# Altium schematic sheet IC_Power.SchDoc: IC Power
size 431 x 279 mm; Author: Eric Liu; SheetNumber: 6; SheetTotal: 7
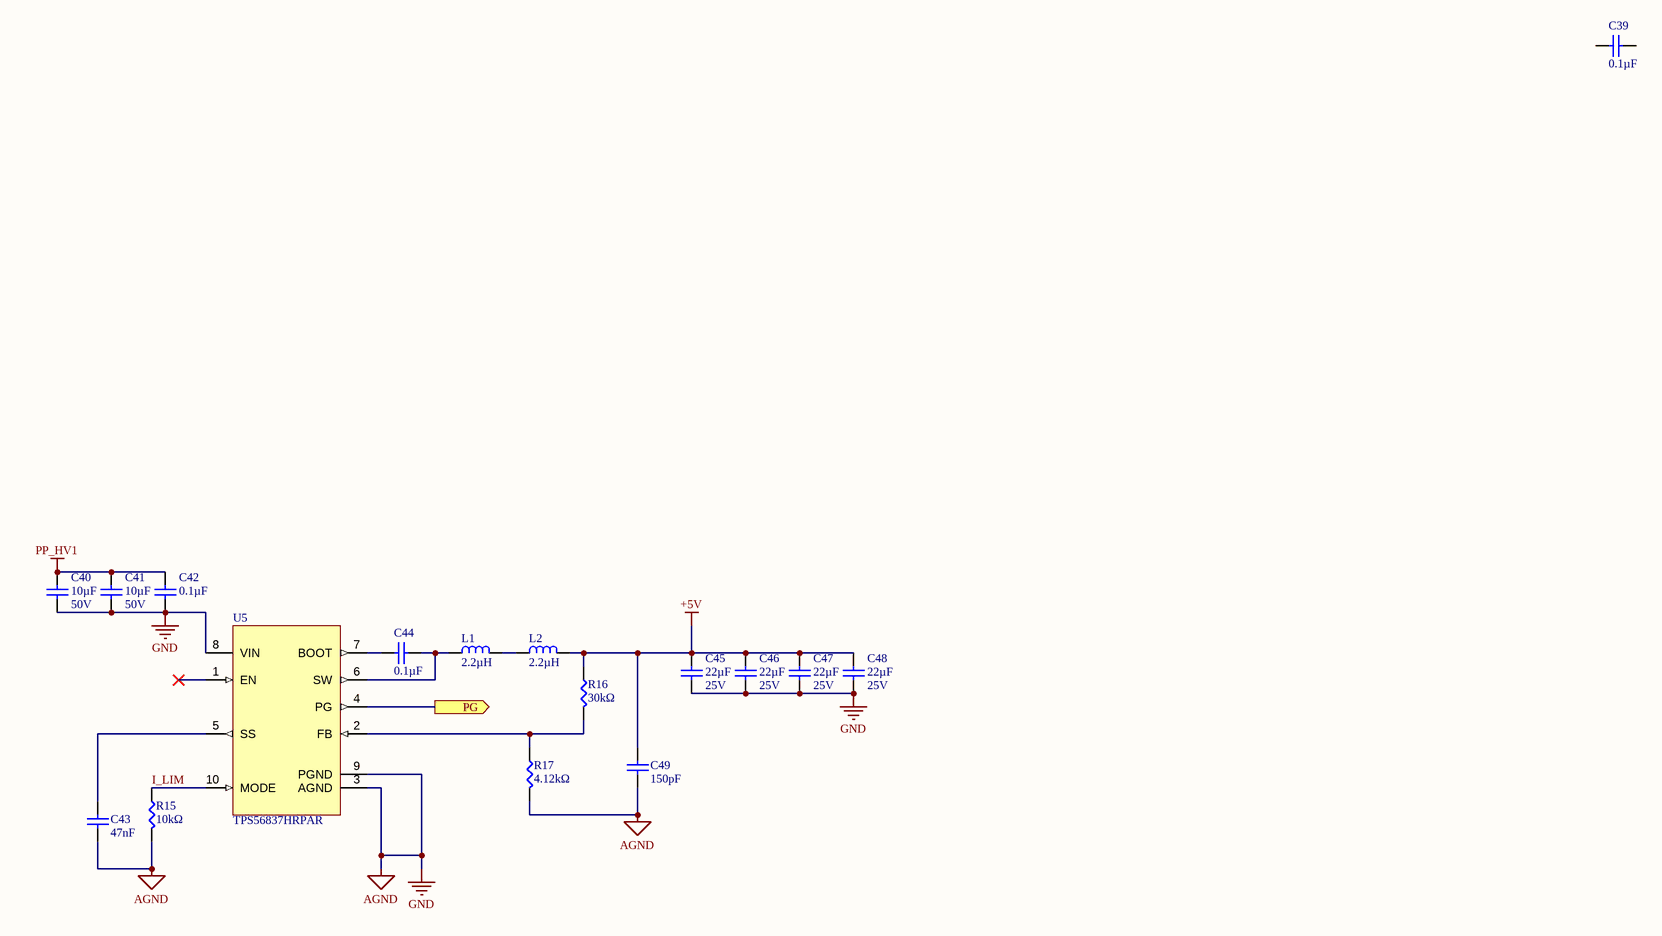
[diagram p0: IC_Power.SchDoc]

## Parts
C39  value 0.1µF  [CAP0402]  (hidden comment: CC0402KRX5R9BB104)
C40  value 10µF  Voltage: 50V  [CAP1206]  (hidden comment: CL31A106KBHNNNE)
C41  value 10µF  Voltage: 50V  [CAP1206]  (hidden comment: CL31A106KBHNNNE)
C42  value 0.1µF  [CAP0402]  (hidden comment: CC0402KRX5R9BB104)
C43  value 47nF  [CAP0402]  (hidden comment: GRM155R71H473KE14D)
C44  value 0.1µF  [CAP0402]  (hidden comment: CC0402KRX5R9BB104)
C45  value 22µF  Voltage: 25V  [CAP0805]  (hidden comment: CL21A226MAYNNNE)
C46  value 22µF  Voltage: 25V  [CAP0805]  (hidden comment: CL21A226MAYNNNE)
C47  value 22µF  Voltage: 25V  [CAP0805]  (hidden comment: CL21A226MAYNNNE)
C48  value 22µF  Voltage: 25V  [CAP0805]  (hidden comment: CL21A226MAYNNNE)
C49  value 150pF  [CAP0402]  (hidden comment: GCM1555C1H151JA16J)
L1  value 2.2µH  (hidden comment: AMELH6020S-2R2MT)
L2  value 2.2µH  (hidden comment: AMELH6020S-2R2MT)
R15  value 10kΩ  [RES0402]  (hidden comment: RC0402FR-0710KL)
R16  value 30kΩ  [RES0402]  (hidden comment: ERJ-2RKF3002X)
R17  value 4.12kΩ  [RES0402]  (hidden comment: RMCF0402FT4K12)
U5  TPS56837HRPAR

## Ports
PG (out)

## Nets
+5V: C45.2 C46.2 C47.2 C48.2 C49.2 L2.2 R16.2
AGND: C40.1 C41.1 C42.1 C43.1 C45.1 C46.1 C47.1 C48.1 C49.1 R15.1 R17.1 U5.3(AGND) U5.8(VIN) U5.9(PGND)  [also labelled GND]
PP_HV1: C40.2 C41.2 C42.2
I_LIM: R15.2 U5.10(MODE)
PG: U5.4(PG) ; port PG
NetC43_2: C43.2 U5.5(SS)
NetC44_1: C44.1 U5.7(BOOT)
NetC44_2: C44.2 L1.1 U5.6(SW)
NetL1_2: L1.2 L2.1
NetR16_1: R16.1 R17.2 U5.2(FB)

Not connected (* = marked no-connect by the designer): C39 1 2; U5 1(EN)*

## Notes on the sheet
- DWG. NO.
- REV.
- SHT.
- THIS DOCUMENT AND THE DATA DISCLOSED HEREIN OR HEREWITH IS THE PROPERTY OF ALTIUM LIMITED AND MAY BE FREELY DISTRIBUTED IN WHOLE. NO RIGHTS ARE RESERVED OR EXPRESS OR IMPLIED WARANTEE GIVEN.
- REVISION
- DESCRIPTION
- DATE
- APPROVED
- ENG:
- APPROVALS
- PROJECT
- DSN:
- CHK:
- REFERENCE DOCUMENTS
- PROJECT REVISION:
- TITLE
- DOCUMENT REVISION:
- DESIGN ITEM:
- BOM:
- FAB DWG:
- PCB DWG:
- ASSY DWG:
- SCALE:
- SIZE
- B
- CAGE CODE
- FILE NAME
- DWG NO.
- SHEET
- OF
- REV

## Library data of the parts
C39 C42 C44 = CC0402KRX5R9BB104: 0.1 µF ±10% 50V Ceramic Capacitor X5R 0402 (1005 Metric); Temperature Coefficient: X5R; Package: 0402 (1005 Metric); Voltage: 50V
C40 C41 = CL31A106KBHNNNE: 10 µF ±10% 50V Ceramic Capacitor X5R 1206 (3216 Metric); Temperature Coefficient: X5R; Package: 1206 (3216 Metric)
C43 = GRM155R71H473KE14D: 0.047 µF ±10% 50V Ceramic Capacitor X7R 0402 (1005 Metric); Temperature Coefficient: X7R; Package: 0402 (1005 Metric); Voltage: 50V
C45-C48 = CL21A226MAYNNNE: 22 µF ±20% 25V Ceramic Capacitor X5R 0805 (2012 Metric); Temperature Coefficient: X5R; Package: 0805 (2012 Metric)
C49 = GCM1555C1H151JA16J: 150 pF ±5% 50V Ceramic Capacitor C0G, NP0 0402 (1005 Metric); Temperature Coefficient: C0G, NP0; Package: 0402 (1005 Metric); Voltage: 50V
L1 L2 = AMELH6020S-2R2MT: 2.2 µH Shielded Molded Inductor 11.5 A 14.4mOhm Max Nonstandard; Manufacturer 1: Abracon LLC; Current Rating: 11.5A; Current - Saturation (Isat): 10A; Manufacturer Part Number 1: AMELH6020S-2R2MT; Supplier Part Number 1: 535-AMELH6020S-2R2MTCT-ND; Supplier 1: Digi-Key
R15 = RC0402FR-0710KL: 10 kOhms ±1% 0.063W, 1/16W Chip Resistor 0402 (1005 Metric) Moisture Resistant Thick Film; Manufacturer 1: YAGEO; Manufacturer Part Number 1: RC0402FR-0710KL; Supplier Part Number 1: 311-10.0KLRCT-ND; Supplier 1: Digi-Key; Power Rating: 1/16W
R16 = ERJ-2RKF3002X: 30 kOhms ±1% 0.1W, 1/10W Chip Resistor 0402 (1005 Metric) Automotive AEC-Q200 Thick Film; Manufacturer 1: Panasonic Electronic Components; Manufacturer Part Number 1: ERJ-2RKF3002X; Supplier Part Number 1: P30.0KLCT-ND; Supplier 1: Digi-Key; Power Rating: 1/10W
R17 = RMCF0402FT4K12: 4.12 kOhms ±1% 0.063W, 1/16W Chip Resistor 0402 (1005 Metric) Automotive AEC-Q200 Thick Film; Manufacturer 1: Stackpole Electronics Inc; Manufacturer Part Number 1: RMCF0402FT4K12; Supplier Part Number 1: RMCF0402FT4K12CT-ND; Supplier 1: Digi-Key; Power Rating: 1/16W
U5 = TPS56837HRPAR: Buck Switching Regulator IC Positive Adjustable 4V 1 Output 8A 10-PowerVFQFN; Manufacturer: Texas Instruments; Manufacturer Product Number: TPS56837HRPAR; Supplier: DigiKey; Supplier Part Number: 296-TPS56837HRPARCT-ND; Datasheet: https://www.ti.com/lit/ds/symlink/tps56837h.pdf?ts=1769746400344&ref_url=https%253A%252F%252Fwww.ti.com%252Fproduct%252FTPS56837H%252Fpart-details%252FTPS56837HARPAR; Operating Temperature: -40°C ~ 150°C